# Altium project UL-SWAP-DAQ-1.PrjPcb (part 1 of 2)
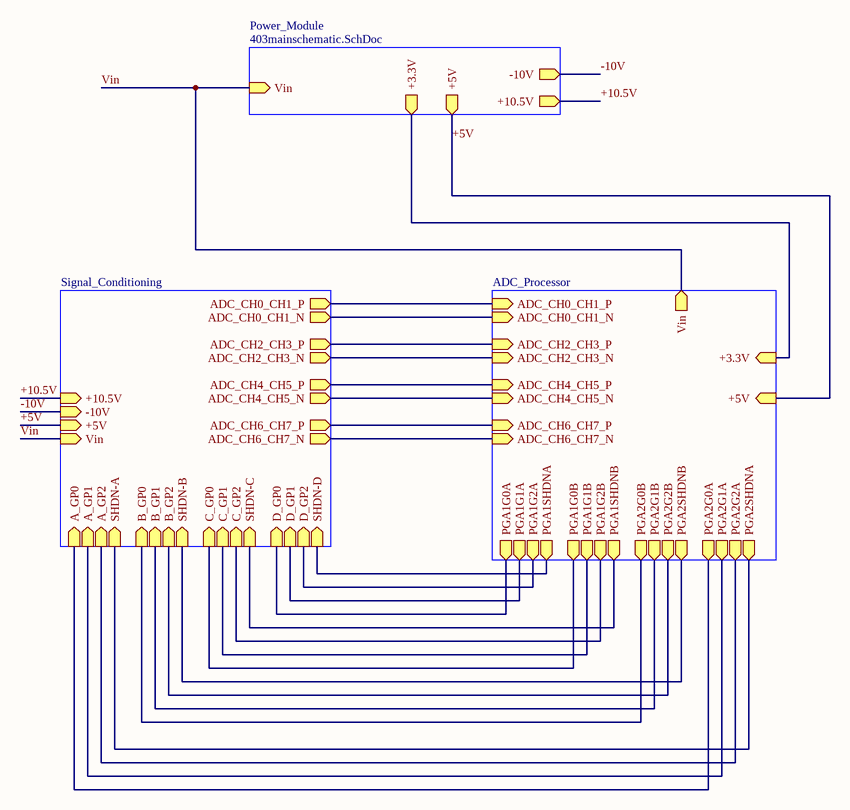
[diagram p0: UL-SWAP-DaQ-Schematic.SchDoc]
15 sheets, 164 parts. Net scope: hierarchical (ports join the sheet entries above them; power ports are global).
Board files: ADC_PIC32_LVDS_DRIVER_Subsystem.PcbDoc, UL-SWAP-DAQ-1.PcbDoc, UL-SWAP-DAQ-2.PcbDoc, pcb403.PcbDoc, Capstone_Signal_Conditioning_Subsystem_Test_PCB.PcbDoc, Power_PCB.PcbDoc, UL-SWAP-DAQ-3.PcbDoc
Sheets:
  UL-SWAP-DaQ-Schematic.SchDoc
    Signal_Conditioning = Capstone_Signal_Conditioners_Subsystem_Test_Schematic.SchDoc
      U4 = THS7002CPWP_Schematic.SchDoc
      U6 = LTC6362_Schematic.SchDoc
      U5 = THS7002CPWP_Schematic_2.SchDoc
      U8 = LTC6362_Schematic_2.SchDoc
    ADC_Processor = ADC_PIC32_LVDS_DRIVER_Subsystem.SchDoc
      ADC_Subsystem = ADC_Subsystem.SchDoc
      PIC32_Subsystem = PIC32_Subsystem.SchDoc
      LVDS_Driver_Subsystem = LVDS_Driver_Subsystem.SchDoc
      ICD4_INTERFACE_MODULE = ICD4_Interface_Module.SchDoc
    Power_Module = 403mainschematic.SchDoc
      LMR51420 3.3V = LMR514203.3V.SchDoc
      LMR51420 5V = LMR514205V.SchDoc
      TPS6513x = TPS6513x.SchDoc

## Sheet UL-SWAP-DaQ-Schematic.SchDoc
size A; SheetNumber: 1; SheetTotal: 15

### Sub-sheets
ADC_Processor = ADC_PIC32_LVDS_DRIVER_Subsystem.SchDoc: PGA1G0A (out), PGA1G1A (out), PGA1G2A (out), PGA1SHDNA (out), PGA1G0B (out), PGA1G2B (out), PGA1SHDNB (out), PGA1G1B (out), PGA2G0B (out), PGA2G1B (out), PGA2G2B (out), PGA2SHDNB (out), PGA2G0A (out), PGA2G1A (out), PGA2G2A (out), PGA2SHDNA (out), ADC_CH6_CH7_N (in), ADC_CH6_CH7_P (in), ADC_CH4_CH5_N (in), ADC_CH4_CH5_P (in), ADC_CH2_CH3_N (in), ADC_CH2_CH3_P (in), ADC_CH0_CH1_P (in), ADC_CH0_CH1_N (in), +5V (in), +3.3V (in), Vin (out)
Power_Module = 403mainschematic.SchDoc: Vin (in), -10V (out), +3.3V (out), +10.5V (out), +5V (out)
Signal_Conditioning = Capstone_Signal_Conditioners_Subsystem_Test_Schematic.SchDoc: A_GP0 (in), A_GP1 (in), A_GP2 (in), SHDN-A (in), B_GP0 (in), B_GP1 (in), B_GP2 (in), SHDN-B (in), C_GP0 (in), C_GP1 (in), C_GP2 (in), SHDN-C (in), D_GP2 (in), D_GP1 (in), D_GP0 (in), SHDN-D (in), ADC_CH0_CH1_P (out), ADC_CH0_CH1_N (out), ADC_CH2_CH3_P (out), ADC_CH2_CH3_N (out), ADC_CH4_CH5_N (out), ADC_CH4_CH5_P (out), ADC_CH6_CH7_P (out), ADC_CH6_CH7_N (out), +10.5V (in), -10V (in), +5V (in), Vin (in)

### Nets
+3.3V: sheet ADC_Processor/+3.3V, sheet Power_Module/+3.3V
+5V: sheet Signal_Conditioning/+5V, sheet ADC_Processor/+5V, sheet Power_Module/+5V
+10.5V: sheet Signal_Conditioning/+10.5V, sheet Power_Module/+10.5V
-10V: sheet Signal_Conditioning/-10V, sheet Power_Module/-10V
A_GP0: sheet Signal_Conditioning/A_GP0, sheet ADC_Processor/PGA2G0A
A_GP1: sheet Signal_Conditioning/A_GP1, sheet ADC_Processor/PGA2G1A
A_GP2: sheet Signal_Conditioning/A_GP2, sheet ADC_Processor/PGA2G2A
ADC_CH0_CH1_N: sheet Signal_Conditioning/ADC_CH0_CH1_N, sheet ADC_Processor/ADC_CH0_CH1_N
ADC_CH0_CH1_P: sheet Signal_Conditioning/ADC_CH0_CH1_P, sheet ADC_Processor/ADC_CH0_CH1_P
ADC_CH2_CH3_N: sheet Signal_Conditioning/ADC_CH2_CH3_N, sheet ADC_Processor/ADC_CH2_CH3_N
ADC_CH2_CH3_P: sheet Signal_Conditioning/ADC_CH2_CH3_P, sheet ADC_Processor/ADC_CH2_CH3_P
ADC_CH4_CH5_N: sheet Signal_Conditioning/ADC_CH4_CH5_N, sheet ADC_Processor/ADC_CH4_CH5_N
ADC_CH4_CH5_P: sheet Signal_Conditioning/ADC_CH4_CH5_P, sheet ADC_Processor/ADC_CH4_CH5_P
ADC_CH6_CH7_N: sheet Signal_Conditioning/ADC_CH6_CH7_N, sheet ADC_Processor/ADC_CH6_CH7_N
ADC_CH6_CH7_P: sheet Signal_Conditioning/ADC_CH6_CH7_P, sheet ADC_Processor/ADC_CH6_CH7_P
B_GP0: sheet Signal_Conditioning/B_GP0, sheet ADC_Processor/PGA2G0B
B_GP1: sheet Signal_Conditioning/B_GP1, sheet ADC_Processor/PGA2G1B
B_GP2: sheet Signal_Conditioning/B_GP2, sheet ADC_Processor/PGA2G2B
C_GP0: sheet Signal_Conditioning/C_GP0, sheet ADC_Processor/PGA1G0B
C_GP1: sheet Signal_Conditioning/C_GP1, sheet ADC_Processor/PGA1G1B
C_GP2: sheet Signal_Conditioning/C_GP2, sheet ADC_Processor/PGA1G2B
D_GP0: sheet Signal_Conditioning/D_GP0, sheet ADC_Processor/PGA1G0A
D_GP1: sheet Signal_Conditioning/D_GP1, sheet ADC_Processor/PGA1G1A
D_GP2: sheet Signal_Conditioning/D_GP2, sheet ADC_Processor/PGA1G2A
SHDN-A: sheet Signal_Conditioning/SHDN-A, sheet ADC_Processor/PGA2SHDNA
SHDN-B: sheet Signal_Conditioning/SHDN-B, sheet ADC_Processor/PGA2SHDNB
SHDN-C: sheet Signal_Conditioning/SHDN-C, sheet ADC_Processor/PGA1SHDNB
SHDN-D: sheet Signal_Conditioning/SHDN-D, sheet ADC_Processor/PGA1SHDNA
Vin: sheet Signal_Conditioning/Vin, sheet ADC_Processor/Vin, sheet Power_Module/Vin

## Sheet Capstone_Signal_Conditioners_Subsystem_Test_Schematic.SchDoc
size A; SheetNumber: 11; SheetTotal: 15
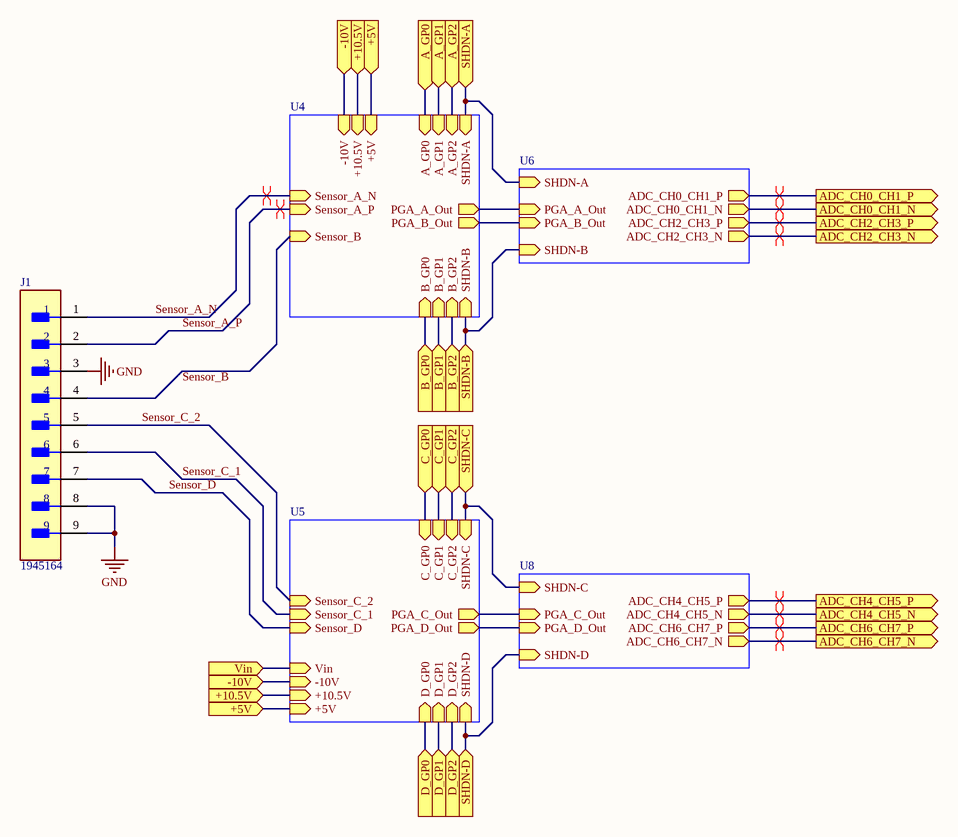
[diagram p1: Capstone_Signal_Conditioners_Subsystem_Test_Schematic.SchDoc]

### Parts
J1  1945164  [1945164]

### Sub-sheets
U4 = THS7002CPWP_Schematic.SchDoc: Sensor_A_P (in), Sensor_A_N (in), A_GP0 (in), A_GP1 (in), A_GP2 (in), PGA_A_Out (out), PGA_B_Out (out), B_GP0 (in), B_GP1 (in), B_GP2 (in), SHDN-A (in), SHDN-B (in), -10V (in), +10.5V (in), +5V (in), Sensor_B (in)
U5 = THS7002CPWP_Schematic_2.SchDoc: C_GP0 (in), D_GP0 (in), C_GP1 (in), C_GP2 (in), D_GP1 (in), D_GP2 (in), SHDN-C (in), SHDN-D (in), PGA_C_Out (out), PGA_D_Out (out), -10V (in), +10.5V (in), +5V (in), Vin (in), Sensor_C_1 (in), Sensor_C_2 (in), Sensor_D (in)
U6 = LTC6362_Schematic.SchDoc: PGA_A_Out (in), PGA_B_Out (in), SHDN-A (in), SHDN-B (in), ADC_CH0_CH1_P (out), ADC_CH0_CH1_N (out), ADC_CH2_CH3_N (out), ADC_CH2_CH3_P (out)
U8 = LTC6362_Schematic_2.SchDoc: SHDN-C (in), SHDN-D (in), ADC_CH6_CH7_N (out), ADC_CH6_CH7_P (out), ADC_CH4_CH5_N (out), ADC_CH4_CH5_P (out), PGA_C_Out (in), PGA_D_Out (in)

### Ports
+5V (in), +10.5V (in), -10V (in), A_GP0 (in), A_GP1 (in), A_GP2 (in), ADC_CH0_CH1_N (out), ADC_CH0_CH1_P (out), ADC_CH2_CH3_N (out), ADC_CH2_CH3_P (out), ADC_CH4_CH5_N (out), ADC_CH4_CH5_P (out), ADC_CH6_CH7_N (out), ADC_CH6_CH7_P (out), B_GP0 (in), B_GP1 (in), B_GP2 (in), C_GP0 (in), C_GP1 (in), C_GP2 (in), D_GP0 (in), D_GP1 (in), D_GP2 (in), SHDN-A (in), SHDN-B (in), SHDN-C (in), SHDN-D (in), Vin (in)

### Nets
+5V: port +5V, sheet U4/+5V, sheet U5/+5V
GND: J1.3 J1.8 J1.9
+10.5V: port +10.5V, sheet U4/+10.5V, sheet U5/+10.5V
-10V: port -10V, sheet U4/-10V, sheet U5/-10V
A_GP0: port A_GP0, sheet U4/A_GP0
A_GP1: port A_GP1, sheet U4/A_GP1
A_GP2: port A_GP2, sheet U4/A_GP2
ADC_CH0_CH1_N: port ADC_CH0_CH1_N, sheet U6/ADC_CH0_CH1_N
ADC_CH0_CH1_P: port ADC_CH0_CH1_P, sheet U6/ADC_CH0_CH1_P
ADC_CH2_CH3_N: port ADC_CH2_CH3_N, sheet U6/ADC_CH2_CH3_N
ADC_CH2_CH3_P: port ADC_CH2_CH3_P, sheet U6/ADC_CH2_CH3_P
ADC_CH4_CH5_N: port ADC_CH4_CH5_N, sheet U8/ADC_CH4_CH5_N
ADC_CH4_CH5_P: port ADC_CH4_CH5_P, sheet U8/ADC_CH4_CH5_P
ADC_CH6_CH7_N: port ADC_CH6_CH7_N, sheet U8/ADC_CH6_CH7_N
ADC_CH6_CH7_P: port ADC_CH6_CH7_P, sheet U8/ADC_CH6_CH7_P
B_GP0: port B_GP0, sheet U4/B_GP0
B_GP1: port B_GP1, sheet U4/B_GP1
B_GP2: port B_GP2, sheet U4/B_GP2
C_GP0: port C_GP0, sheet U5/C_GP0
C_GP1: port C_GP1, sheet U5/C_GP1
C_GP2: port C_GP2, sheet U5/C_GP2
D_GP0: port D_GP0, sheet U5/D_GP0
D_GP1: port D_GP1, sheet U5/D_GP1
D_GP2: port D_GP2, sheet U5/D_GP2
PGA_A_Out: sheet U4/PGA_A_Out, sheet U6/PGA_A_Out
PGA_B_Out: sheet U4/PGA_B_Out, sheet U6/PGA_B_Out
PGA_C_Out: sheet U5/PGA_C_Out, sheet U8/PGA_C_Out
PGA_D_Out: sheet U5/PGA_D_Out, sheet U8/PGA_D_Out
Sensor_A_N: J1.1 ; sheet U4/Sensor_A_N
Sensor_A_P: J1.2 ; sheet U4/Sensor_A_P
Sensor_B: J1.4 ; sheet U4/Sensor_B
Sensor_C_1: J1.6 ; sheet U5/Sensor_C_1
Sensor_C_2: J1.5 ; sheet U5/Sensor_C_2
Sensor_D: J1.7 ; sheet U5/Sensor_D
SHDN-A: port SHDN-A, sheet U4/SHDN-A, sheet U6/SHDN-A
SHDN-B: port SHDN-B, sheet U4/SHDN-B, sheet U6/SHDN-B
SHDN-C: port SHDN-C, sheet U5/SHDN-C, sheet U8/SHDN-C
SHDN-D: port SHDN-D, sheet U5/SHDN-D, sheet U8/SHDN-D
Vin: port Vin, sheet U5/Vin

### Layout directives
differential pair: ADC_CH0_CH1_N, ADC_CH0_CH1_P, ADC_CH2_CH3_N, ADC_CH2_CH3_P, ADC_CH4_CH5_N, ADC_CH4_CH5_P, ADC_CH6_CH7_N, ADC_CH6_CH7_P, Sensor_A_N, Sensor_A_P

### Notes on the sheet
- Labels drawn without touching a wire or pin: Sensor_B

### Library data of the parts
J1 = 1945164: TERM BLOCK HDR 9POS VERT 3.5MM; Manufacturer Part Number: 4-644456-0; Manufacturer: TE Connectivity; Current Rating: 5A; Conn Gender: Male; Number Of Contacts: 10; Conn Orientation: Vertical; Voltage Rating: 250V; Number Of Rows: 1; Device Class L3: unset; Octopart: https://octopart.com/4-644456-0-te+connectivity-39514173; Pitch: 3.5mm; Mouser Description: TERM BLOCK HDR 9POS VERT 3.5MM; ComponentLink2Description: Datasheet; Height: 0.408inch; Package: 4-644456-0; RoHS: TRUE; Temperature Range High: +105°C; Digikey Description: CONN HEADER VERT 10POS 2.54MM; Temperature: -55°C to +105°C; Device Class L2: Headers and Wire Housings; Automotive: No; Lead Free: Yes; Contact Material: Tin; Temperature Range Low: -55°C; Footprint Url: https://www.te.com/commerce/DocumentDelivery/DDEController?Action=showdoc&DocId=Customer+Drawing%7F644456%7FD2%7Fpdf%7FEnglish%7FENG_CD_644456_D2.pdf%7F4-644456-0; Device Class L1: Connectors; Category: Conn; ComponentLink2URL: https://media.digikey.com/pdf/Data%20Sheets/Phoenix%20Contact%20PDFs/Combicon%20Compact%20Series.pdf

## Sheet THS7002CPWP_Schematic.SchDoc
size A; SheetNumber: 12; SheetTotal: 15
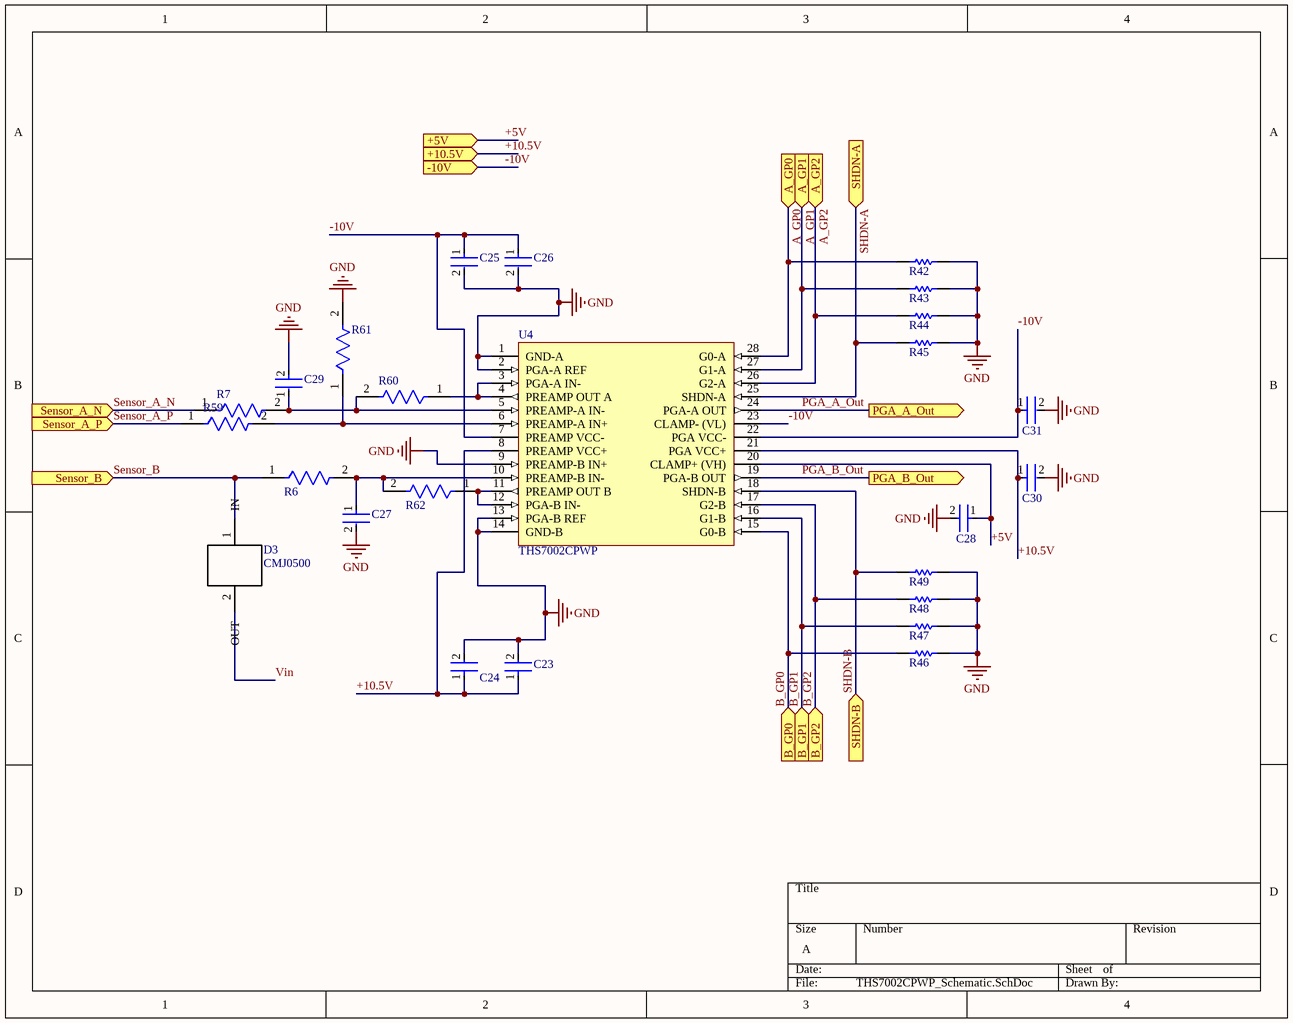
[diagram p2: THS7002CPWP_Schematic.SchDoc]

### Parts
C23  (no value)  [FP-C2012-060-0_2-IPC_A]
C24  CC0603KRX7R7BB104  [FP-CC0603-DA-MFG]  (value not drawn)
C25  CC0603KRX7R7BB104  [FP-CC0603-DA-MFG]  (value not drawn)
C26  (no value)  [FP-C2012-060-0_2-IPC_A]
C27  GRM2195C1H622JA01D  [FP-GRM219-0_1-IPC_C]  (value not drawn)
C28  (no value)  [FP-C2012-060-0_2-IPC_A]
C29  GRM2165C1H302JA01D  [FP-GRM216-0_1-IPC_A]  (value not drawn)
C30  CC0603KRX7R7BB104  [FP-CC0603-DA-MFG]  (value not drawn)
C31  CC0603KRX7R7BB104  [FP-CC0603-DA-MFG]  (value not drawn)
D3  CMJ0500  [CMJ2000_Footprint]
R6  CRCW0603499RFKEA  [FP-CRCW0603-e3-MFG]  (value not drawn)
R7  CRCW0603499RFKEA  [FP-CRCW0603-e3-MFG]  (value not drawn)
R42  RC0603FR-073K3L  [RESC1608X55X25ML10T15]  (value not drawn)
R43  RC0603FR-073K3L  [RESC1608X55X25ML10T15]  (value not drawn)
R44  RC0603FR-073K3L  [RESC1608X55X25ML10T15]  (value not drawn)
R45  RC0603FR-073K3L  [RESC1608X55X25ML10T15]  (value not drawn)
R46  RC0603FR-073K3L  [RESC1608X55X25ML10T15]  (value not drawn)
R47  RC0603FR-073K3L  [RESC1608X55X25ML10T15]  (value not drawn)
R48  RC0603FR-073K3L  [RESC1608X55X25ML10T15]  (value not drawn)
R49  RC0603FR-073K3L  [RESC1608X55X25ML10T15]  (value not drawn)
R59  CRCW0603499RFKEA  [FP-CRCW0603-e3-MFG]  (value not drawn)
R60  CRCW0603499RFKEA  [FP-CRCW0603-e3-MFG]  (value not drawn)
R61  CRCW0603499RFKEA  [FP-CRCW0603-e3-MFG]  (value not drawn)
R62  CRCW0603499RFKEA  [FP-CRCW0603-e3-MFG]  (value not drawn)
U4  THS7002CPWP  [THS7002CPWP]

### Ports
+5V (in), +10.5V (in), -10V (in), A_GP0 (in), A_GP1 (in), A_GP2 (in), B_GP0 (in), B_GP1 (in), B_GP2 (in), PGA_A_Out (out), PGA_B_Out (out), Sensor_A_N (in), Sensor_A_P (in), Sensor_B (in), SHDN-A (in), SHDN-B (in)

### Nets
+5V: C28.1 U4.20(CLAMP+_(VH)) ; port +5V
GND: C23.2 C24.2 C25.2 C26.2 C27.2 C28.2 C29.2 C30.2 C31.2 R42.1 R43.1 R44.1 R45.1 R46.1 R47.1 R48.1 R49.1 R61.2 U4.1(GND-A) U4.2(PGA-A_REF) U4.9(PREAMP-B_IN+) U4.13(PGA-B_REF) U4.14(GND-B)
+10.5V: C23.1 C24.1 C30.1 U4.8(PREAMP_VCC+) U4.21(PGA_VCC+) ; port +10.5V
-10V: C25.1 C26.1 C31.1 U4.7(PREAMP_VCC-) U4.22(PGA_VCC-) U4.23(CLAMP-_(VL)) ; port -10V
A_GP0: R42.2 U4.28(G0-A) ; port A_GP0
A_GP1: R43.2 U4.27(G1-A) ; port A_GP1
A_GP2: R44.2 U4.26(G2-A) ; port A_GP2
B_GP0: R46.2 U4.15(G0-B) ; port B_GP0
B_GP1: R47.2 U4.16(G1-B) ; port B_GP1
B_GP2: R48.2 U4.17(G2-B) ; port B_GP2
PGA_A_Out: U4.24(PGA-A_OUT) ; port PGA_A_Out
PGA_B_Out: U4.19(PGA-B_OUT) ; port PGA_B_Out
Sensor_A_N: R7.1 ; port Sensor_A_N
Sensor_A_P: R59.1 ; port Sensor_A_P
Sensor_B: R6.1 ; port Sensor_B
SHDN-A: R45.2 U4.25(SHDN-A) ; port SHDN-A
SHDN-B: R49.2 U4.18(SHDN-B) ; port SHDN-B
NetC27_1: C27.1 R6.2 R62.2 U4.10(PREAMP-B_IN-)
NetC29_1: C29.1 R7.2 R60.2 U4.5(PREAMP-A_IN-)
NetR59_2: R59.2 R61.1 U4.6(PREAMP-A_IN+)
NetR60_1: R60.1 U4.3(PGA-A_IN-) U4.4(PREAMP_OUT_A)
NetR62_1: R62.1 U4.11(PREAMP_OUT_B) U4.12(PGA-B_IN-)

Not connected (* = marked no-connect by the designer): D3 1(IN) 2(OUT)

### Library data of the parts
C23 C26 C28 = CMP-08246-004641-1: Multilayer Ceramic Capacitors 6.8μF ±10% 10V JB SMD 0805; Capacitance: 6.8uF; RoHS Compliant: Yes; Case Code (Metric): 5032; Case/Package: 0805; Voltage Rating: 10V; Width: 0.049inch; Min Operating Temperature: -25°C; Mount: Surface Mount; Voltage Rating (DC): 10V; Dielectric Material: Ceramic; Case Code (Imperial): 2012; Package Quantity: 4000; Lead Free: Lead Free; Packaging: Tape and Reel; Length: 0.079inch; Tolerance: 10%; Thickness: 0.028inch; Max Operating Temperature: 85°C; Series: C
C24 C25 C30 C31 = CMP-2000-05002-2: CAP CER 0.1UF 16V X7R 0603; Manufacturer: YAGEO; Tolerance: 0.1; Value: 100 nF; Temperature Coefficient: 15%; Material: Ceramic; Voltage Rating: 16 V; Package: CC0603-DA; ComponentLink2Description: Datasheet; Octopart: https://octopart.com/cc0603krx7r7bb104-yageo-192941; Temperature Range High: +125°C; Digikey Description: CAP CER 0.1UF 16V X7R 0603; Voltage: 16 V; Device Class L2: Capacitors; Height: 0.9mm; Temperature: -55°C to +125°C; Manufacturer Part Number: CC0603KRX7R7BB104; Device Class L1: Passive Components; Device Class L3: Ceramic Capacitors; ComponentLink2URL: http://www.yageo.com/documents/recent/UPY-GPHC_X7R_6.3V-to-50V_18.pdf; Footprint Url: http://www.yageo.com/exep/pages/download/literatures/UPY-C_GEN_24.pdf; RoHS: TRUE; Temperature Range Low: -55°C; Temperature Characteristic: X7R; Lead Free: Yes; Capacitance: 100 nF; Category: Cap; Mouser Description: Multilayer Ceramic Capacitor, CC Series, 0.1 - F, - 10%, X7R, 16 V, 0603 [1608 Metric]; Automotive: No
C27 = CMP-2007-00144-2: Chip Multilayer Ceramic Capacitors for General Purpose, 0805, 6200pF, C0G, 30ppm/°C, 5%, 50V; Capacitance: 6.2nF; Termination: SMD/SMT; Tolerance: 5%; Radiation Hardening: No; Voltage: 50V; Lead Free: Lead Free; Case Code (Imperial): 0805; Width: 0.049inch; Thickness: 0.037inch; Depth: 1.25mm; Mount: Surface Mount; Length: 2mm; Packaging: Tape and Reel; Voltage Rating (DC): 50V; Case/Package: 0805; Height: 0.85mm; Package Quantity: 1; Dielectric: C0G; Min Operating Temperature: -55°C; Max Operating Temperature: 125°C; Voltage Rating: 50V; Case Code (Metric): 2012
C29 = CMP-06035-063048-1: Chip Multilayer Ceramic Capacitors for General Purpose, 0805, 3000pF, C0G, 30ppm/°C, 5%, 50V; Capacitance: 3nF; Package Quantity: 1; Mount: Surface Mount; Voltage Rating: 50V; Length: 2mm; Case Code (Imperial): 0805; Depth: 1.25mm; Termination: SMD/SMT; Case Code (Metric): 2012; RoHS Compliant: Yes; Packaging: Tape and Reel; Case/Package: 0805; Width: 1.25mm; Height: 0.6mm; Max Operating Temperature: 125°C; Min Operating Temperature: -55°C; Voltage: 50V; Series: GRM; Voltage Rating (DC): 50V; Thickness: 0.028inch; Lead Free: Lead Free; Dielectric: C0G; Tolerance: 5%
D3 = CMJ2000/0130: CMJ0500: DIODE CUR REG 100V 0.5mA 500MW; ComponentLink1Description: New link; ComponentLink1URL: *
R6 R7 R59-R62 = CMP-2000-03390-2: RES Thick Film, 499Ω, 1%, 0.1W, 100ppm/°C, 0603; Voltage Rating (DC): 75V; Power Rating: 100mW; Resistance: 499R; Case/Package: 0603; Package Quantity: 5000; Military Standard: Not; Length: 1.55mm; Width: 0.85mm; Number of Terminations: 2; Lead Free: Lead Free; Height: 0.45mm; Weight: 7.1E-05oz; Composition: Thick Film; Radiation Hardening: No; Max Operating Temperature: 155°C; Tolerance: 1%; Working Voltage: 75V; Temperature Coefficient: 100ppm/°C; Packaging: Tape and Reel; Contact Plating: Tin; Termination: SMD/SMT; Depth: 0.85mm; Case Code (Metric): 1608; Min Operating Temperature: -55°C; Mount: Surface Mount; Case Code (Imperial): 0603; Voltage Rating: 75V
R42-R49 = CMP-1012-00567-2: Chip Resistor, 3.3 KOhm, +/- 1%, 0.1 W, -55 to 155 degC, 0603 (1608 Metric), RoHS, Tape and Reel; Manufacturer: Yageo; Temperature Coefficient: 100ppm/degreesC; Voltage Rating: 50V; Max Power Dissipation: 100mW; Resistance: 3.3KOhm; Case Code (Metric): 1608; Case/Package: 0603; Composition: ThickFilm; RoHSCompliant: true; Datasheet Version: Rev. 5, 10/2016; REACH SVHC: NoSVHC; Width: 0.8mm; Package Quantity: 1; Depth: 0.8mm; Voltage Rating (DC): 50V; Termination: SMD/SMT; Length: 1.6mm; Lead Free: LeadFree; Package Description: 2-Pin Surface Mount Device, Body 1.6 x 0.8 mm; Max Operating Temperature: 155degC; Tolerance: 1%; Height: 0.45mm; Number of Pins: 2; Military Standard: Not; Power Rating: 100mW; Datasheet URL: http://www.yageo.com/NewPortal/yageodocoutput?fileName=/pdf/R-Chip/PYu-RC_Group_51_RoHS_L_5.pdf; Case Code (Imperial): 0603; Manufacturer URL: http://www.yageo.com/; Packaging: TapeandReel; Min Operating Temperature: -55degC; Package Reference: 0603; Number of Terminations: 2
U4 = CMP-0988-00132-2: 70-MHz High-Speed Programmable-Gain Amplifier, Dual, 0 to 70 degC, 28-pin SOP (PWP28), Green (RoHS & no Sb/Br); Manufacturer: Texas Instruments; Disable: TRUE; BW @ Acl(MHz): 100; Vs(Min)(V): 9; Vs(Max)(V): 32; Number of Channels: 2; Vio(Max)(mV): 7; Iib(Max)(nA): 6000; SubFamily: Variable Gain Amplifier; Vn at Flatband(Typ)(nV/rtHz): 1.7; Slew Rate(Typ)(V/us): 85; ComponentLink1Description: Manufacturer URL; Code_JEDEC: MO-153; PackageVersion: 4073225-6/I, 05/2011; PackageReference: PWP0028E; Eco-Plan: Green (RoHS & no Sb/Br); ComponentLink2URL: http://www.ti.com/general/docs/lit/getliterature.tsp?genericPartNumber=THS7002&fileType=pdf; PackageDescription: 28-Pin Plastic Small Outline, Body 4.4 x 9.7 mm, Pitch 0.65 mm; DatasheetVersion: SLOS214C; ComponentLink3URL: http://www.ti.com/litv/pdf/mpds373; ComponentLink3Description: Package Specification; ComponentLink1URL: http://www.ti.com/; ComponentLink2Description: Datasheet; Mounting Technology: Surface Mount; PartNumber: THS7002CPWP

## Sheet LTC6362_Schematic.SchDoc
size A; SheetNumber: 13; SheetTotal: 15
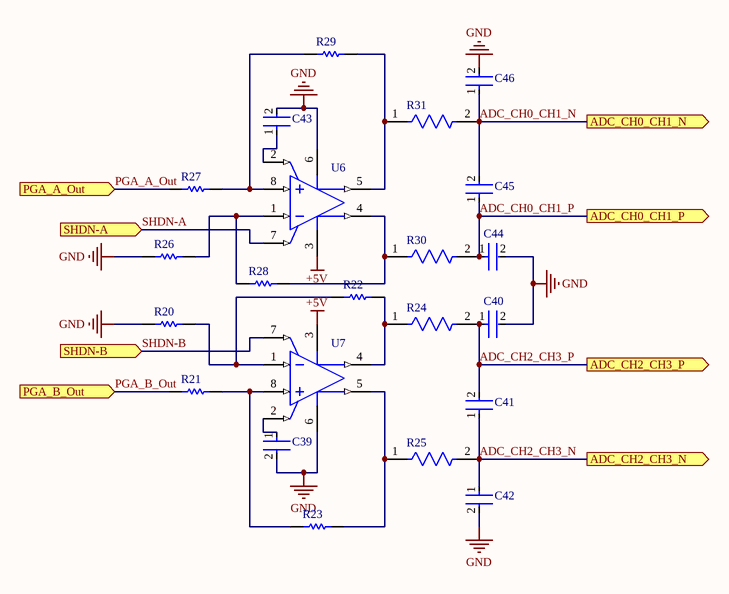
[diagram p3: LTC6362_Schematic.SchDoc]

### Parts
C39  GQM1875C2ER10BB12D  [FP-GQM187-0_15-MFG]  (value not drawn)
C40  CC0603KRX7R9BB392  [FP-CC0603-DA-MFG]  (value not drawn)
C41  CC0603KRX7R9BB392  [FP-CC0603-DA-MFG]  (value not drawn)
C42  CC0603KRX7R9BB392  [FP-CC0603-DA-MFG]  (value not drawn)
C43  GQM1875C2ER10BB12D  [FP-GQM187-0_15-MFG]  (value not drawn)
C44  CC0603KRX7R9BB392  [FP-CC0603-DA-MFG]  (value not drawn)
C45  CC0603KRX7R9BB392  [FP-CC0603-DA-MFG]  (value not drawn)
C46  CC0603KRX7R9BB392  [FP-CC0603-DA-MFG]  (value not drawn)
R20  ERJ-6ENF1241V  [RESC2013X70X40LL20T20]  (value not drawn)
R21  ERJ-6ENF1241V  [RESC2013X70X40LL20T20]  (value not drawn)
R22  RC0805FR-071KL  [RESC2013X60X35ML10T20]  (value not drawn)
R23  RC0805FR-071KL  [RESC2013X60X35ML10T20]  (value not drawn)
R24  CRCW060335R7FKEA  [FP-CRCW0603-e3-IPC_B]  (value not drawn)
R25  CRCW060335R7FKEA  [FP-CRCW0603-e3-IPC_B]  (value not drawn)
R26  ERJ-6ENF1241V  [RESC2013X70X40LL20T20]  (value not drawn)
R27  ERJ-6ENF1241V  [RESC2013X70X40LL20T20]  (value not drawn)
R28  RC0805FR-071KL  [RESC2013X60X35ML10T20]  (value not drawn)
R29  RC0805FR-071KL  [RESC2013X60X35ML10T20]  (value not drawn)
R30  CRCW060335R7FKEA  [FP-CRCW0603-e3-IPC_B]  (value not drawn)
R31  CRCW060335R7FKEA  [FP-CRCW0603-e3-IPC_B]  (value not drawn)
U6  LTC6362HMS8#PBF  [LT-MS8-8_L]  (value not drawn)
U7  LTC6362HMS8#PBF  [LT-MS8-8_L]  (value not drawn)

### Ports
ADC_CH0_CH1_N (out), ADC_CH0_CH1_P (out), ADC_CH2_CH3_N (out), ADC_CH2_CH3_P (out), PGA_A_Out (in), PGA_B_Out (in), SHDN-A (in), SHDN-B (in)

### Nets
+5V: U6.3(V+) U7.3(V+)
GND: C39.2 C40.2 C42.2 C43.2 C44.2 C46.2 R20.1 R26.1 U6.6(V-) U7.6(V-)
ADC_CH0_CH1_N: C45.2 C46.1 R31.2 ; port ADC_CH0_CH1_N
ADC_CH0_CH1_P: C44.1 C45.1 R30.2 ; port ADC_CH0_CH1_P
ADC_CH2_CH3_N: C41.1 C42.1 R25.2 ; port ADC_CH2_CH3_N
ADC_CH2_CH3_P: C40.1 C41.2 R24.2 ; port ADC_CH2_CH3_P
PGA_A_Out: R27.1 ; port PGA_A_Out
PGA_B_Out: R21.1 ; port PGA_B_Out
SHDN-A: U6.7(~{SHDN}) ; port SHDN-A
SHDN-B: U7.7(~{SHDN}) ; port SHDN-B
NetC39_1: C39.1 U7.2(VOCM)
NetC43_1: C43.1 U6.2(VOCM)
NetR20_2: R20.2 R22.1 U7.1(-IN)
NetR21_2: R21.2 R23.1 U7.8(+IN)
NetR22_2: R22.2 R24.1 U7.4(+OUT)
NetR23_2: R23.2 R25.1 U7.5(-OUT)
NetR26_2: R26.2 R28.1 U6.1(-IN)
NetR27_2: R27.2 R29.1 U6.8(+IN)
NetR28_2: R28.2 R30.1 U6.4(+OUT)
NetR29_2: R29.2 R31.1 U6.5(-OUT)

### Library data of the parts
C39 C43 = CMP-06035-052255-1: Ceramic Capacitor 0.1pF ±0.1pF 250VDC C0G 0603 Paper T/R; Voltage Rating: 250V; Width: 0.031inch; Length: 1.6mm; Max Operating Temperature: 125°C; Min Operating Temperature: -55°C; Height: 0.7mm; Dielectric: C0G; Termination: SMD/SMT; Depth: 0.8mm; Case/Package: 0603; Package Quantity: 4000; Radiation Hardening: No; Case Code (Metric): 1608; Thickness: 0.031inch; Capacitance: 0.1pF; Case Code (Imperial): 0603; Voltage Rating (DC): 250V; Packaging: Tape and Reel; Mount: Surface Mount
C40-C42 C44-C46 = CMP-03422-000635-2: CAP CER 3900PF 50V X7R 0603; Tolerance: 10%; Dielectric Material: Ceramic; Capacitance: 3.9nF; Insulation Resistance: 100GR; Height: 0.8mm; Voltage Rating: 50V; Termination: SMD/SMT; REACH SVHC: No SVHC; Resistor Type: Ceramic; Radiation Hardening: No; Case Code (Imperial): 0603; Voltage: 50V; Series: CC; Mount: Surface Mount; Length: 1.6mm; RoHS Compliant: Yes; Lead Free: Lead Free; Width: 0.8mm; Package Quantity: 4000; Packaging: Tape and Reel; Dielectric: X7R; Voltage Rating (DC): 50V; Min Operating Temperature: -55°C; Depth: 0.8mm; Halogen Free: Halogen Free; Case/Package: 0603; Thickness: 0.035inch; Number of Pins: 2; Max Operating Temperature: 125°C; Case Code (Metric): 1608; Construction: Flat
R20 R21 R26 R27 = CMP-2001-04406-1: Manufacturer: Panasonic; Part Number: ERJ-6ENF1241V
R22 R23 R28 R29 = CMP-2100-03671-1: Chip Resistor, 1 KOhm, +/- 1%, 125 mW, -55 to 155 degC, 0805 (2012 Metric), RoHS, Tape and Reel; Manufacturer: Yageo; Temperature Coefficient: 100ppm/degreesC; Voltage Rating (DC): 150V; Max Power Dissipation: 125mW; Resistance: 1KOhm; Number of Pins: 2; Number of Terminations: 2; Datasheet URL: http://www.yageo.com/NewPortal/yageodocoutput?fileName=/pdf/R-Chip/PYu-RC_Group_51_RoHS_L_5.pdf; Length: 0.079inch; Package Description: 2-Pin Surface Mounted Device, Body 2 x 1.25 mm; Depth: 1.25mm; Height: 0.024inch; Military Standard: Not; Case/Package: 0805; Package Reference: 0805; RoHSCompliant: true; Lead Free: LeadFree; Packaging: TapeandReel; Package Quantity: 1; Datasheet Version: Rev. 5, 10/2016; Tolerance: 1%; Min Operating Temperature: -55degC; Voltage Rating: 150V; Composition: ThickFilm; Case Code (Imperial): 0805; Power Rating: 125mW; Width: 0.049inch; Case Code (Metric): 2012; Manufacturer URL: http://www.yageo.com/; Max Operating Temperature: 155degC; REACH SVHC: Unknown; Termination: SMD/SMT
R24 R25 R30 R31 = CMP-02407-005475-1: RES Thick Film, 35.7Ω, 1%, 0.1W, 100ppm/°C, 0603; Resistance: 35.7R; Max Power Dissipation: 100mW; Voltage Rating (DC): 75V; Weight: 7.1E-05oz; Contact Plating: Tin; Width: 0.85mm; Features: Automotive AEC-Q200; Package Quantity: 10; Tolerance: 1%; Height: 0.02inch; Mount: Surface Mount; Packaging: Tape and Reel; Termination: SMD/SMT; Power Rating: 100mW; Case Code (Metric): 1608; Case/Package: 0603; Voltage Rating: 75V; Depth: 0.85mm; Number of Terminations: 2; Composition: Thick Film; Lead Free: Lead Free; Max Operating Temperature: 155°C; Case Code (Imperial): 0603; Min Operating Temperature: -55°C; Radiation Hardening: No; Length: 1.55mm; Number of Pins: 2; Military Standard: Not; Temperature Coefficient: 100ppm/°C
U6 U7 = CMP-0359-00920-2: Single Channel, Precision, Low Power Differential Operational Amplifier / SAR ADC Driver, RRIO, 180 MHz Typical GBW, 45 V/us Typical SR, 2.8 to 5.25 V, 8-Pin SOP (MS8-8), High Temperature / Automotive, Pb-Free; Manufacturer: Linear Technology; Vs Max (V): 5.25; Is (mA) Typical: 0.9; SR (V/us) Typical: 45; Channels (#): 1; GBW (MHz) Typical: 180; Vos (mV) Typical: 0.05; Vs Min (V): 2.8; PartNumber: LTC6362HMS8#PBF; PackageDescription: 8-Lead Plastic Small Outline, Body 3.9 x 4.9 mm, Pitch 1.27 mm; ComponentLink2Description: Datasheet; ComponentLink3URL: http://cds.linear.com/docs/en/packaging/05081610_G_SO8.pdf; ComponentLink1Description: Manufacturer URL; PackageReference: LT-MS8-8; ComponentLink2URL: http://cds.linear.com/docs/en/datasheet/6362fa.pdf; PackageVersion: Rev G; Mounting Technology: Surface Mount; Linear Technology Part Number: LTC6362; DatasheetVersion: Rev. A; RevisionNote: URLs updated; RoHS: Pb-Free; ComponentLink1URL: http://www.linear.com/; Type: DIFF; ComponentLink3Description: Package Specification

## Sheet THS7002CPWP_Schematic_2.SchDoc
size A; SheetNumber: 15; SheetTotal: 15
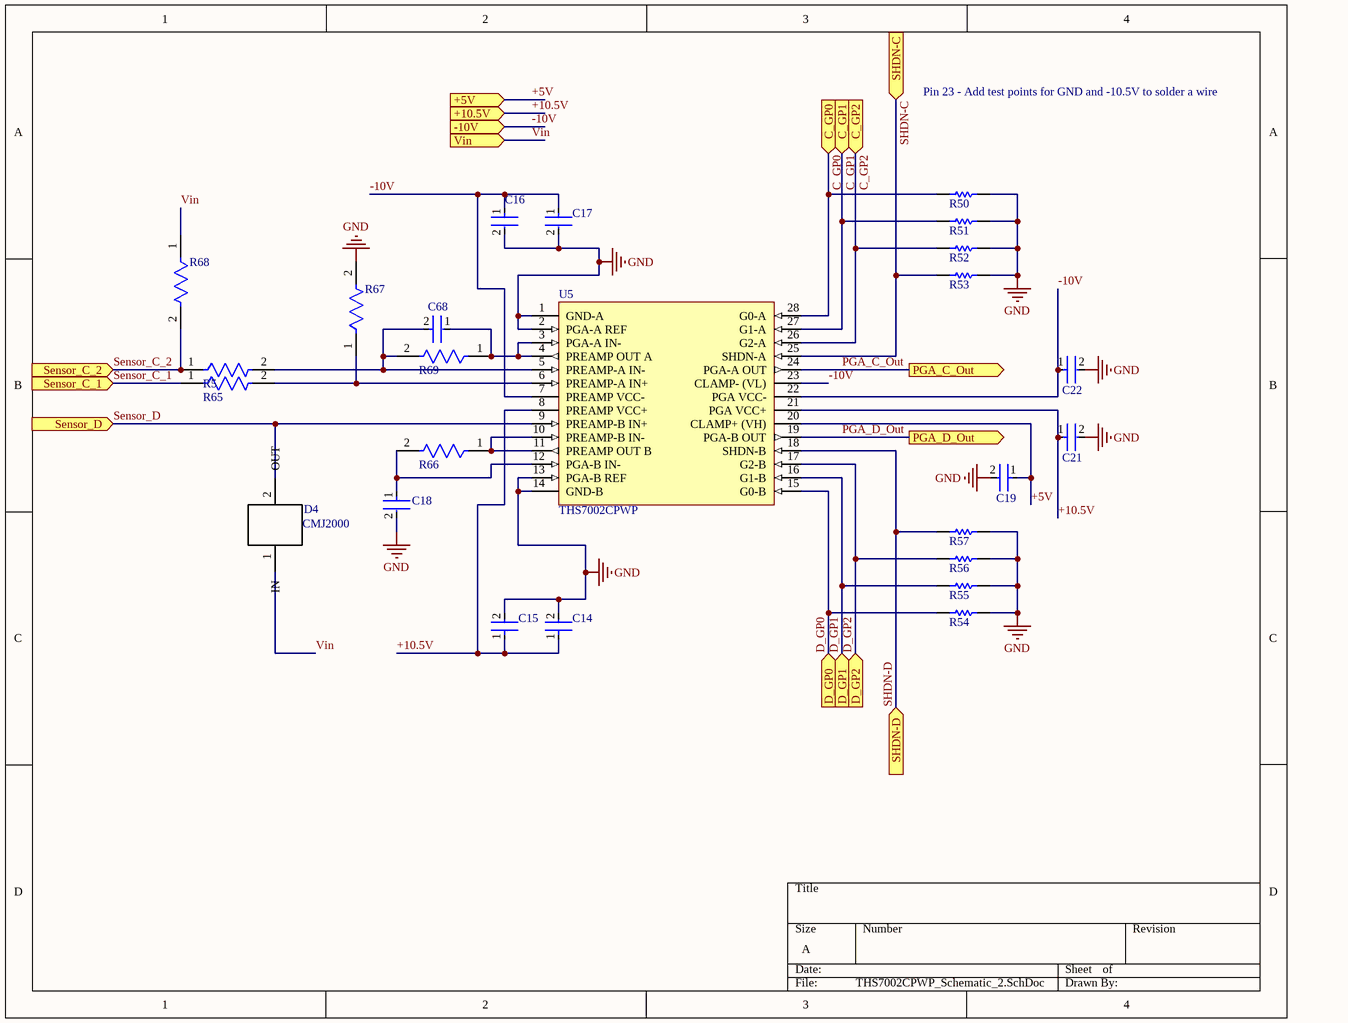
[diagram p4: THS7002CPWP_Schematic_2.SchDoc]

### Parts
C14  (no value)  [FP-C2012-060-0_2-IPC_A]
C15  CC0603KRX7R7BB104  [FP-CC0603-DA-MFG]  (value not drawn)
C16  CC0603KRX7R7BB104  [FP-CC0603-DA-MFG]  (value not drawn)
C17  (no value)  [FP-C2012-060-0_2-IPC_A]
C18  GRM2195C1H622JA01D  [FP-GRM219-0_1-IPC_C]  (value not drawn)
C19  (no value)  [FP-C2012-060-0_2-IPC_A]
C21  CC0603KRX7R7BB104  [FP-CC0603-DA-MFG]  (value not drawn)
C22  CC0603KRX7R7BB104  [FP-CC0603-DA-MFG]  (value not drawn)
C68  GRM31CR60J227ME11K  [FP-GRM31C-0_3-e0_3_0_9-IPC_C]  (value not drawn)
D4  CMJ2000  [CMJ2000_Footprint]
R5  CRCW0603499RFKEA  [FP-CRCW0603-e3-MFG]  (value not drawn)
R50  RC0603FR-073K3L  [RESC1608X55X25ML10T15]  (value not drawn)
R51  RC0603FR-073K3L  [RESC1608X55X25ML10T15]  (value not drawn)
R52  RC0603FR-073K3L  [RESC1608X55X25ML10T15]  (value not drawn)
R53  RC0603FR-073K3L  [RESC1608X55X25ML10T15]  (value not drawn)
R54  RC0603FR-073K3L  [RESC1608X55X25ML10T15]  (value not drawn)
R55  RC0603FR-073K3L  [RESC1608X55X25ML10T15]  (value not drawn)
R56  RC0603FR-073K3L  [RESC1608X55X25ML10T15]  (value not drawn)
R57  RC0603FR-073K3L  [RESC1608X55X25ML10T15]  (value not drawn)
R65  CRCW0603499RFKEA  [FP-CRCW0603-e3-MFG]  (value not drawn)
R66  CRCW0603499RFKEA  [FP-CRCW0603-e3-MFG]  (value not drawn)
R67  CRCW0603499RFKEA  [FP-CRCW0603-e3-MFG]  (value not drawn)
R68  RC0603FR-07100KL  [FP-RC0603-0_55-MFG]  (value not drawn)
R69  CRCW0603499RFKEA  [FP-CRCW0603-e3-MFG]  (value not drawn)
U5  THS7002CPWP  [THS7002CPWP]

### Ports
+5V (in), +10.5V (in), -10V (in), C_GP0 (in), C_GP1 (in), C_GP2 (in), D_GP0 (in), D_GP1 (in), D_GP2 (in), PGA_C_Out (out), PGA_D_Out (out), Sensor_C_1 (in), Sensor_C_2 (in), Sensor_D (in), SHDN-C (in), SHDN-D (in), Vin (in)

### Nets
+5V: C19.1 U5.20(CLAMP+_(VH)) ; port +5V
GND: C14.2 C15.2 C16.2 C17.2 C18.2 C19.2 C21.2 C22.2 R50.1 R51.1 R52.1 R53.1 R54.1 R55.1 R56.1 R57.1 R67.2 U5.1(GND-A) U5.2(PGA-A_REF) U5.13(PGA-B_REF) U5.14(GND-B)
+10.5V: C14.1 C15.1 C21.1 U5.8(PREAMP_VCC+) U5.21(PGA_VCC+) ; port +10.5V
-10V: C16.1 C17.1 C22.1 U5.7(PREAMP_VCC-) U5.22(PGA_VCC-) U5.23(CLAMP-_(VL)) ; port -10V
C_GP0: R50.2 U5.28(G0-A) ; port C_GP0
C_GP1: R51.2 U5.27(G1-A) ; port C_GP1
C_GP2: R52.2 U5.26(G2-A) ; port C_GP2
D_GP0: R54.2 U5.15(G0-B) ; port D_GP0
D_GP1: R55.2 U5.16(G1-B) ; port D_GP1
D_GP2: R56.2 U5.17(G2-B) ; port D_GP2
PGA_C_Out: U5.24(PGA-A_OUT) ; port PGA_C_Out
PGA_D_Out: U5.19(PGA-B_OUT) ; port PGA_D_Out
Sensor_C_1: R65.1 ; port Sensor_C_1
Sensor_C_2: R5.1 R68.2 ; port Sensor_C_2
Sensor_D: U5.9(PREAMP-B_IN+) ; port Sensor_D
SHDN-C: R53.2 U5.25(SHDN-A) ; port SHDN-C
SHDN-D: R57.2 U5.18(SHDN-B) ; port SHDN-D
Vin: R68.1 ; port Vin
NetC18_1: C18.1 R66.2 U5.12(PGA-B_IN-)
NetC68_1: C68.1 R69.1 U5.3(PGA-A_IN-) U5.4(PREAMP_OUT_A)
NetC68_2: C68.2 R5.2 R69.2 U5.5(PREAMP-A_IN-)
NetR65_2: R65.2 R67.1 U5.6(PREAMP-A_IN+)
NetR66_1: R66.1 U5.10(PREAMP-B_IN-) U5.11(PREAMP_OUT_B)

Not connected (* = marked no-connect by the designer): D4 1(IN) 2(OUT)

### Notes on the sheet
- Pin 23 - Add test points for GND and -10.5V to solder a wire

### Library data of the parts
C14 C17 C19 = CMP-08246-004641-1: as C23 on sheet THS7002CPWP_Schematic; RoHS Compliant: Yes; Case Code (Metric): 5032; Case/Package: 0805; Voltage Rating: 10V; Width: 0.049inch; Min Operating Temperature: -25°C; Mount: Surface Mount; Voltage Rating (DC): 10V; Dielectric Material: Ceramic; Case Code (Imperial): 2012; Package Quantity: 4000; Lead Free: Lead Free; Packaging: Tape and Reel; Length: 0.079inch; Tolerance: 10%; Thickness: 0.028inch; Max Operating Temperature: 85°C; Series: C
C15 C16 C21 C22 = CMP-2000-05002-2: as C24 on sheet THS7002CPWP_Schematic; Voltage Rating: 16 V; Package: CC0603-DA; ComponentLink2Description: Datasheet; Octopart: https://octopart.com/cc0603krx7r7bb104-yageo-192941; Temperature Range High: +125°C; Digikey Description: CAP CER 0.1UF 16V X7R 0603; Voltage: 16 V; Device Class L2: Capacitors; Height: 0.9mm; Temperature: -55°C to +125°C; Manufacturer Part Number: CC0603KRX7R7BB104; Device Class L1: Passive Components; Device Class L3: Ceramic Capacitors; ComponentLink2URL: http://www.yageo.com/documents/recent/UPY-GPHC_X7R_6.3V-to-50V_18.pdf; Footprint Url: http://www.yageo.com/exep/pages/download/literatures/UPY-C_GEN_24.pdf; RoHS: TRUE; Temperature Range Low: -55°C; Temperature Characteristic: X7R; Lead Free: Yes; Capacitance: 100 nF; Category: Cap; Mouser Description: Multilayer Ceramic Capacitor, CC Series, 0.1 - F, - 10%, X7R, 16 V, 0603 [1608 Metric]; Automotive: No
C18 = CMP-2007-00144-2: as C27 on sheet THS7002CPWP_Schematic; Termination: SMD/SMT; Tolerance: 5%; Radiation Hardening: No; Voltage: 50V; Lead Free: Lead Free; Case Code (Imperial): 0805; Width: 0.049inch; Thickness: 0.037inch; Depth: 1.25mm; Mount: Surface Mount; Length: 2mm; Packaging: Tape and Reel; Voltage Rating (DC): 50V; Case/Package: 0805; Height: 0.85mm; Package Quantity: 1; Dielectric: C0G; Min Operating Temperature: -55°C; Max Operating Temperature: 125°C; Voltage Rating: 50V; Case Code (Metric): 2012
C68 = CMP-06035-026847-1: Chip Multilayer Ceramic Capacitors for General Purpose, 1206, 220uF, X5R, 15%, 20%, 6.3V; Thickness: 1.6mm; Tolerance: 20%; Length: 3.2mm; Width: 1.6mm; Dielectric: X5R; Voltage Rating (DC): 6.3V; Capacitance: 220uF
D4 = CMJ2000: DIODE CUR REG 100V 2.32MA 500MW; ComponentLink1Description: New link; ComponentLink1URL: *
R5 R65-R67 R69 = CMP-2000-03390-2: as R6 on sheet THS7002CPWP_Schematic; Case/Package: 0603; Package Quantity: 5000; Military Standard: Not; Length: 1.55mm; Width: 0.85mm; Number of Terminations: 2; Lead Free: Lead Free; Height: 0.45mm; Weight: 7.1E-05oz; Composition: Thick Film; Radiation Hardening: No; Max Operating Temperature: 155°C; Tolerance: 1%; Working Voltage: 75V; Temperature Coefficient: 100ppm/°C; Packaging: Tape and Reel; Contact Plating: Tin; Termination: SMD/SMT; Depth: 0.85mm; Case Code (Metric): 1608; Min Operating Temperature: -55°C; Mount: Surface Mount; Case Code (Imperial): 0603; Voltage Rating: 75V
R50-R57 = CMP-1012-00567-2: as R42 on sheet THS7002CPWP_Schematic; Resistance: 3.3KOhm; Case Code (Metric): 1608; Case/Package: 0603; Composition: ThickFilm; RoHSCompliant: true; Datasheet Version: Rev. 5, 10/2016; REACH SVHC: NoSVHC; Width: 0.8mm; Package Quantity: 1; Depth: 0.8mm; Voltage Rating (DC): 50V; Termination: SMD/SMT; Length: 1.6mm; Lead Free: LeadFree; Package Description: 2-Pin Surface Mount Device, Body 1.6 x 0.8 mm; Max Operating Temperature: 155degC; Tolerance: 1%; Height: 0.45mm; Number of Pins: 2; Military Standard: Not; Power Rating: 100mW; Datasheet URL: http://www.yageo.com/NewPortal/yageodocoutput?fileName=/pdf/R-Chip/PYu-RC_Group_51_RoHS_L_5.pdf; Case Code (Imperial): 0603; Manufacturer URL: http://www.yageo.com/; Packaging: TapeandReel; Min Operating Temperature: -55degC; Package Reference: 0603; Number of Terminations: 2
R68 = CMP-2100-03662-2: RES SMD 100K OHM 1% 1/10W 0603; Voltage Rating (DC): 50V; Resistance: 100kR; Max Power Dissipation: 100mW; Temperature Coefficient: 100ppm/°C; Working Voltage: 75V; Length: 1.6mm; Lead Free: Lead Free; Number of Terminations: 2; Packaging: Tape and Reel; Voltage Rating: 50V; Termination: SMD/SMT; Width: 0.8mm; Resistor Type: Thick Film; Resistance Tolerance: 1%; Features: Moisture Resistant; Height: 0.45mm; Construction: Rectangular; Case/Package: 0603; Military Standard: Not; Case Code (Imperial): 0603; Series: RC; Technology: THICK FILM; Depth: 0.8mm; RoHS Compliant: Yes; REACH SVHC: No SVHC; Min Operating Temperature: -55°C; Case Code (Metric): 1608; Max Operating Temperature: 155°C; Power Rating: 100mW; Number of Pins: 2; Tolerance: 1%
U5 = CMP-0988-00132-2: as U4 on sheet THS7002CPWP_Schematic; ComponentLink1Description: Manufacturer URL; Code_JEDEC: MO-153; PackageVersion: 4073225-6/I, 05/2011; PackageReference: PWP0028E; Eco-Plan: Green (RoHS & no Sb/Br); ComponentLink2URL: http://www.ti.com/general/docs/lit/getliterature.tsp?genericPartNumber=THS7002&fileType=pdf; PackageDescription: 28-Pin Plastic Small Outline, Body 4.4 x 9.7 mm, Pitch 0.65 mm; DatasheetVersion: SLOS214C; ComponentLink3URL: http://www.ti.com/litv/pdf/mpds373; ComponentLink3Description: Package Specification; ComponentLink1URL: http://www.ti.com/; ComponentLink2Description: Datasheet; Mounting Technology: Surface Mount; PartNumber: THS7002CPWP

## Sheet LTC6362_Schematic_2.SchDoc
size A; SheetNumber: 14; SheetTotal: 15
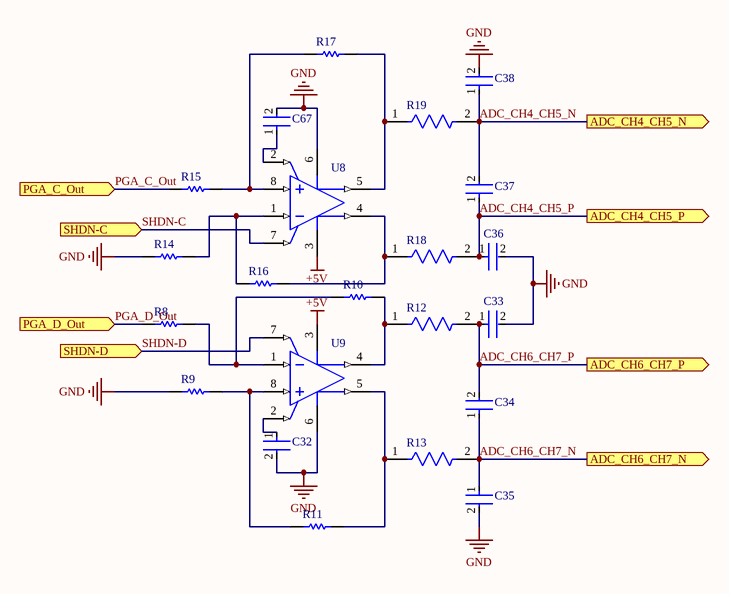
[diagram p5: LTC6362_Schematic_2.SchDoc]

### Parts
C32  GQM1875C2ER10BB12D  [FP-GQM187-0_15-MFG]  (value not drawn)
C33  CC0603KRX7R9BB392  [FP-CC0603-DA-MFG]  (value not drawn)
C34  CC0603KRX7R9BB392  [FP-CC0603-DA-MFG]  (value not drawn)
C35  CC0603KRX7R9BB392  [FP-CC0603-DA-MFG]  (value not drawn)
C36  CC0603KRX7R9BB392  [FP-CC0603-DA-MFG]  (value not drawn)
C37  CC0603KRX7R9BB392  [FP-CC0603-DA-MFG]  (value not drawn)
C38  CC0603KRX7R9BB392  [FP-CC0603-DA-MFG]  (value not drawn)
C67  GQM1875C2ER10BB12D  [FP-GQM187-0_15-MFG]  (value not drawn)
R8  ERJ-6ENF1241V  [RESC2013X70X40LL20T20]  (value not drawn)
R9  ERJ-6ENF1241V  [RESC2013X70X40LL20T20]  (value not drawn)
R10  RC0805FR-071KL  [RESC2013X60X35ML10T20]  (value not drawn)
R11  RC0805FR-071KL  [RESC2013X60X35ML10T20]  (value not drawn)
R12  CRCW060335R7FKEA  [FP-CRCW0603-e3-IPC_B]  (value not drawn)
R13  CRCW060335R7FKEA  [FP-CRCW0603-e3-IPC_B]  (value not drawn)
R14  ERJ-6ENF1241V  [RESC2013X70X40LL20T20]  (value not drawn)
R15  ERJ-6ENF1241V  [RESC2013X70X40LL20T20]  (value not drawn)
R16  RC0805FR-071KL  [RESC2013X60X35ML10T20]  (value not drawn)
R17  RC0805FR-071KL  [RESC2013X60X35ML10T20]  (value not drawn)
R18  CRCW060335R7FKEA  [FP-CRCW0603-e3-IPC_B]  (value not drawn)
R19  CRCW060335R7FKEA  [FP-CRCW0603-e3-IPC_B]  (value not drawn)
U8  LTC6362HMS8#PBF  [LT-MS8-8_L]  (value not drawn)
U9  LTC6362HMS8#PBF  [LT-MS8-8_L]  (value not drawn)

### Ports
ADC_CH4_CH5_N (out), ADC_CH4_CH5_P (out), ADC_CH6_CH7_N (out), ADC_CH6_CH7_P (out), PGA_C_Out (in), PGA_D_Out (in), SHDN-C (in), SHDN-D (in)

### Nets
+5V: U8.3(V+) U9.3(V+)
GND: C32.2 C33.2 C35.2 C36.2 C38.2 C67.2 R9.1 R14.1 U8.6(V-) U9.6(V-)
ADC_CH4_CH5_N: C37.2 C38.1 R19.2 ; port ADC_CH4_CH5_N
ADC_CH4_CH5_P: C36.1 C37.1 R18.2 ; port ADC_CH4_CH5_P
ADC_CH6_CH7_N: C34.1 C35.1 R13.2 ; port ADC_CH6_CH7_N
ADC_CH6_CH7_P: C33.1 C34.2 R12.2 ; port ADC_CH6_CH7_P
PGA_C_Out: R15.1 ; port PGA_C_Out
PGA_D_Out: R8.1 ; port PGA_D_Out
SHDN-C: U8.7(~{SHDN}) ; port SHDN-C
SHDN-D: U9.7(~{SHDN}) ; port SHDN-D
NetC32_1: C32.1 U9.2(VOCM)
NetC67_1: C67.1 U8.2(VOCM)
NetR8_2: R8.2 R10.1 U9.1(-IN)
NetR9_2: R9.2 R11.1 U9.8(+IN)
NetR10_2: R10.2 R12.1 U9.4(+OUT)
NetR11_2: R11.2 R13.1 U9.5(-OUT)
NetR14_2: R14.2 R16.1 U8.1(-IN)
NetR15_2: R15.2 R17.1 U8.8(+IN)
NetR16_2: R16.2 R18.1 U8.4(+OUT)
NetR17_2: R17.2 R19.1 U8.5(-OUT)

### Library data of the parts
C32 C67 = CMP-06035-052255-1: as C39 on sheet LTC6362_Schematic; Width: 0.031inch; Length: 1.6mm; Max Operating Temperature: 125°C; Min Operating Temperature: -55°C; Height: 0.7mm; Dielectric: C0G; Termination: SMD/SMT; Depth: 0.8mm; Case/Package: 0603; Package Quantity: 4000; Radiation Hardening: No; Case Code (Metric): 1608; Thickness: 0.031inch; Capacitance: 0.1pF; Case Code (Imperial): 0603; Voltage Rating (DC): 250V; Packaging: Tape and Reel; Mount: Surface Mount
C33-C38 = CMP-03422-000635-2: as C40 on sheet LTC6362_Schematic; Height: 0.8mm; Voltage Rating: 50V; Termination: SMD/SMT; REACH SVHC: No SVHC; Resistor Type: Ceramic; Radiation Hardening: No; Case Code (Imperial): 0603; Voltage: 50V; Series: CC; Mount: Surface Mount; Length: 1.6mm; RoHS Compliant: Yes; Lead Free: Lead Free; Width: 0.8mm; Package Quantity: 4000; Packaging: Tape and Reel; Dielectric: X7R; Voltage Rating (DC): 50V; Min Operating Temperature: -55°C; Depth: 0.8mm; Halogen Free: Halogen Free; Case/Package: 0603; Thickness: 0.035inch; Number of Pins: 2; Max Operating Temperature: 125°C; Case Code (Metric): 1608; Construction: Flat
R8 R9 R14 R15 = CMP-2001-04406-1: Manufacturer: Panasonic; Part Number: ERJ-6ENF1241V
R10 R11 R16 R17 = CMP-2100-03671-1: as R22 on sheet LTC6362_Schematic; Number of Pins: 2; Number of Terminations: 2; Datasheet URL: http://www.yageo.com/NewPortal/yageodocoutput?fileName=/pdf/R-Chip/PYu-RC_Group_51_RoHS_L_5.pdf; Length: 0.079inch; Package Description: 2-Pin Surface Mounted Device, Body 2 x 1.25 mm; Depth: 1.25mm; Height: 0.024inch; Military Standard: Not; Case/Package: 0805; Package Reference: 0805; RoHSCompliant: true; Lead Free: LeadFree; Packaging: TapeandReel; Package Quantity: 1; Datasheet Version: Rev. 5, 10/2016; Tolerance: 1%; Min Operating Temperature: -55degC; Voltage Rating: 150V; Composition: ThickFilm; Case Code (Imperial): 0805; Power Rating: 125mW; Width: 0.049inch; Case Code (Metric): 2012; Manufacturer URL: http://www.yageo.com/; Max Operating Temperature: 155degC; REACH SVHC: Unknown; Termination: SMD/SMT
R12 R13 R18 R19 = CMP-02407-005475-1: as R24 on sheet LTC6362_Schematic; Weight: 7.1E-05oz; Contact Plating: Tin; Width: 0.85mm; Features: Automotive AEC-Q200; Package Quantity: 10; Tolerance: 1%; Height: 0.02inch; Mount: Surface Mount; Packaging: Tape and Reel; Termination: SMD/SMT; Power Rating: 100mW; Case Code (Metric): 1608; Case/Package: 0603; Voltage Rating: 75V; Depth: 0.85mm; Number of Terminations: 2; Composition: Thick Film; Lead Free: Lead Free; Max Operating Temperature: 155°C; Case Code (Imperial): 0603; Min Operating Temperature: -55°C; Radiation Hardening: No; Length: 1.55mm; Number of Pins: 2; Military Standard: Not; Temperature Coefficient: 100ppm/°C
U8 U9 = CMP-0359-00920-2: as U6 on sheet LTC6362_Schematic; PartNumber: LTC6362HMS8#PBF; PackageDescription: 8-Lead Plastic Small Outline, Body 3.9 x 4.9 mm, Pitch 1.27 mm; ComponentLink2Description: Datasheet; ComponentLink3URL: http://cds.linear.com/docs/en/packaging/05081610_G_SO8.pdf; ComponentLink1Description: Manufacturer URL; PackageReference: LT-MS8-8; ComponentLink2URL: http://cds.linear.com/docs/en/datasheet/6362fa.pdf; PackageVersion: Rev G; Mounting Technology: Surface Mount; Linear Technology Part Number: LTC6362; DatasheetVersion: Rev. A; RevisionNote: URLs updated; RoHS: Pb-Free; ComponentLink1URL: http://www.linear.com/; Type: DIFF; ComponentLink3Description: Package Specification

## Sheet ADC_PIC32_LVDS_DRIVER_Subsystem.SchDoc
size A; SheetNumber: 2; SheetTotal: 15
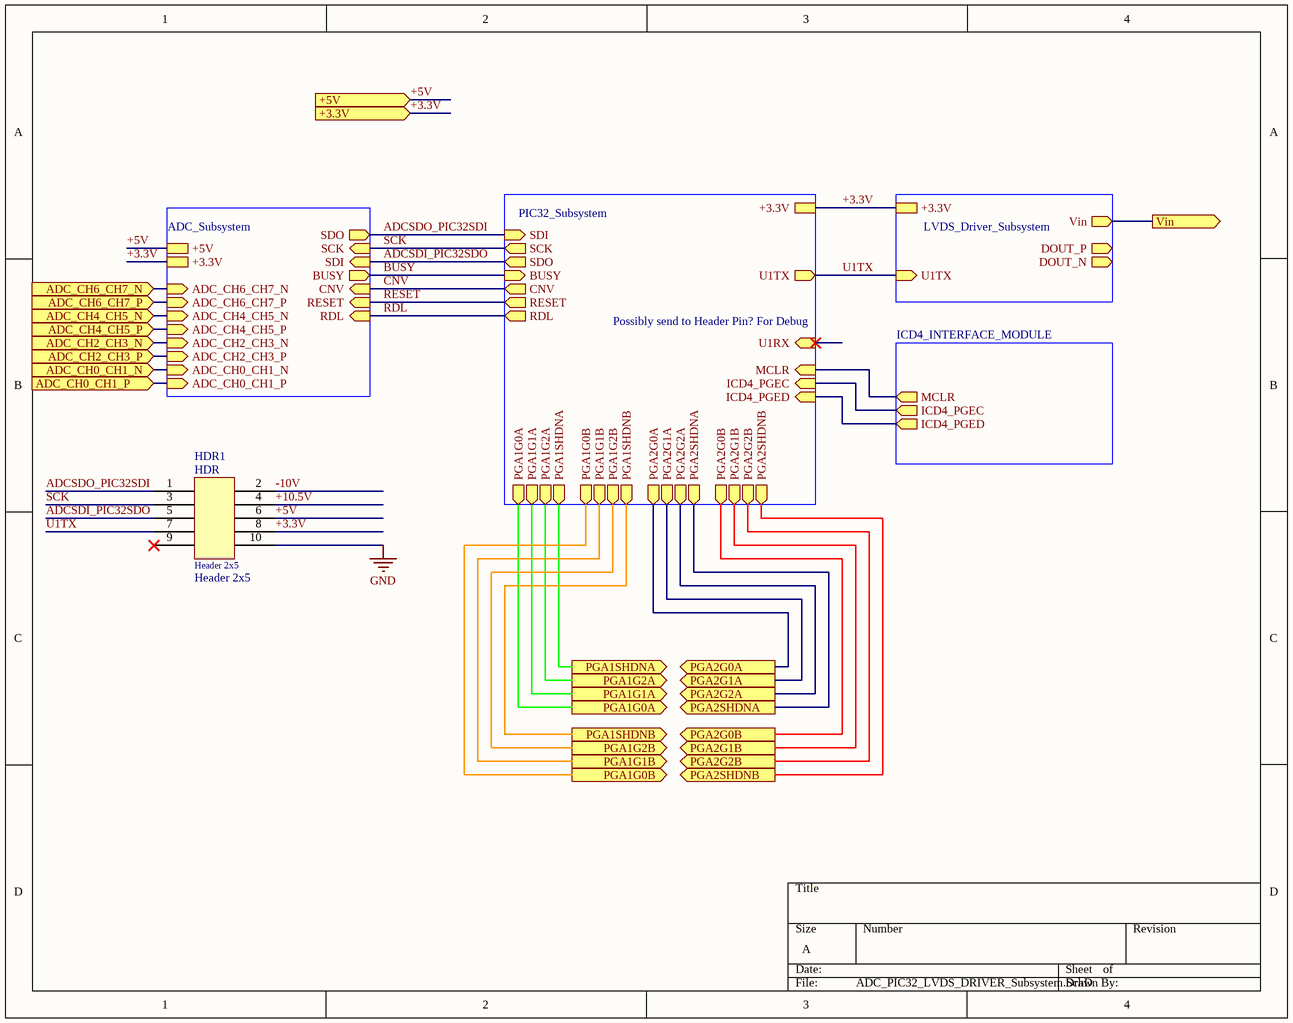
[diagram p6: ADC_PIC32_LVDS_DRIVER_Subsystem.SchDoc]

### Parts
HDR1  Header 2x5

### Sub-sheets
ADC_Subsystem = ADC_Subsystem.SchDoc: SDO (out), SCK (in), SDI (in), BUSY (out), CNV (in), RESET (in), RDL (in), +5V, +3.3V, ADC_CH6_CH7_N (in), ADC_CH6_CH7_P (in), ADC_CH4_CH5_N (in), ADC_CH4_CH5_P (in), ADC_CH2_CH3_N (in), ADC_CH2_CH3_P (in), ADC_CH0_CH1_P (in), ADC_CH0_CH1_N (in)
ICD4_INTERFACE_MODULE = ICD4_Interface_Module.SchDoc: MCLR (out), ICD4_PGEC (out), ICD4_PGED (out)
LVDS_Driver_Subsystem = LVDS_Driver_Subsystem.SchDoc: DOUT_P (out), DOUT_N (out), U1TX (in), +3.3V, Vin (out)
PIC32_Subsystem = PIC32_Subsystem.SchDoc: U1TX (out), U1RX (in), BUSY (in), RESET (out), CNV (out), SDO (out), SCK (out), SDI (in), RDL (out), ICD4_PGED (in), ICD4_PGEC (in), MCLR (in), PGA1G0A (out), PGA1G1A (out), PGA1G2A (out), PGA1SHDNA (out), PGA1G0B (out), PGA1G1B (out), PGA1G2B (out), PGA1SHDNB (out), PGA2G0A (out), PGA2G1A (out), PGA2G2A (out), PGA2SHDNA (out), PGA2G0B (out), PGA2G1B (out), PGA2G2B (out), PGA2SHDNB (out), +3.3V

### Ports
+3.3V (in), +5V (in), ADC_CH0_CH1_N (in), ADC_CH0_CH1_P (in), ADC_CH2_CH3_N (in), ADC_CH2_CH3_P (in), ADC_CH4_CH5_N (in), ADC_CH4_CH5_P (in), ADC_CH6_CH7_N (in), ADC_CH6_CH7_P (in), PGA1G0A (out), PGA1G0B (out), PGA1G1A (out), PGA1G1B (out), PGA1G2A (out), PGA1G2B (out), PGA1SHDNA (out), PGA1SHDNB (out), PGA2G0A (out), PGA2G0B (out), PGA2G1A (out), PGA2G1B (out), PGA2G2A (out), PGA2G2B (out), PGA2SHDNA (out), PGA2SHDNB (out), Vin (out)

### Nets
+3.3V: port +3.3V, sheet ADC_Subsystem/+3.3V, sheet PIC32_Subsystem/+3.3V, sheet LVDS_Driver_Subsystem/+3.3V
+5V: port +5V, sheet ADC_Subsystem/+5V
A_GP0: port PGA2G0A, sheet PIC32_Subsystem/PGA2G0A
A_GP1: port PGA2G1A, sheet PIC32_Subsystem/PGA2G1A
A_GP2: port PGA2G2A, sheet PIC32_Subsystem/PGA2G2A
ADC_CH0_CH1_N: port ADC_CH0_CH1_N, sheet ADC_Subsystem/ADC_CH0_CH1_N
ADC_CH0_CH1_P: port ADC_CH0_CH1_P, sheet ADC_Subsystem/ADC_CH0_CH1_P
ADC_CH2_CH3_N: port ADC_CH2_CH3_N, sheet ADC_Subsystem/ADC_CH2_CH3_N
ADC_CH2_CH3_P: port ADC_CH2_CH3_P, sheet ADC_Subsystem/ADC_CH2_CH3_P
ADC_CH4_CH5_N: port ADC_CH4_CH5_N, sheet ADC_Subsystem/ADC_CH4_CH5_N
ADC_CH4_CH5_P: port ADC_CH4_CH5_P, sheet ADC_Subsystem/ADC_CH4_CH5_P
ADC_CH6_CH7_N: port ADC_CH6_CH7_N, sheet ADC_Subsystem/ADC_CH6_CH7_N
ADC_CH6_CH7_P: port ADC_CH6_CH7_P, sheet ADC_Subsystem/ADC_CH6_CH7_P
ADCSDI_PIC32SDO: sheet ADC_Subsystem/SDI, sheet PIC32_Subsystem/SDO
ADCSDO_PIC32SDI: sheet ADC_Subsystem/SDO, sheet PIC32_Subsystem/SDI
B_GP0: port PGA2G0B, sheet PIC32_Subsystem/PGA2G0B
B_GP1: port PGA2G1B, sheet PIC32_Subsystem/PGA2G1B
B_GP2: port PGA2G2B, sheet PIC32_Subsystem/PGA2G2B
BUSY: sheet ADC_Subsystem/BUSY, sheet PIC32_Subsystem/BUSY
C_GP0: port PGA1G0B, sheet PIC32_Subsystem/PGA1G0B
C_GP1: port PGA1G1B, sheet PIC32_Subsystem/PGA1G1B
C_GP2: port PGA1G2B, sheet PIC32_Subsystem/PGA1G2B
CNV: sheet ADC_Subsystem/CNV, sheet PIC32_Subsystem/CNV
D_GP0: port PGA1G0A, sheet PIC32_Subsystem/PGA1G0A
D_GP1: port PGA1G1A, sheet PIC32_Subsystem/PGA1G1A
D_GP2: port PGA1G2A, sheet PIC32_Subsystem/PGA1G2A
MCLR: sheet PIC32_Subsystem/MCLR, sheet ICD4_INTERFACE_MODULE/MCLR
PGC: sheet PIC32_Subsystem/ICD4_PGEC, sheet ICD4_INTERFACE_MODULE/ICD4_PGEC
PGD: sheet PIC32_Subsystem/ICD4_PGED, sheet ICD4_INTERFACE_MODULE/ICD4_PGED
RDL: sheet ADC_Subsystem/RDL, sheet PIC32_Subsystem/RDL
RESET: sheet ADC_Subsystem/RESET, sheet PIC32_Subsystem/RESET
SCK: sheet ADC_Subsystem/SCK, sheet PIC32_Subsystem/SCK
SHDN-A: port PGA2SHDNA, sheet PIC32_Subsystem/PGA2SHDNA
SHDN-B: port PGA2SHDNB, sheet PIC32_Subsystem/PGA2SHDNB
SHDN-C: port PGA1SHDNB, sheet PIC32_Subsystem/PGA1SHDNB
SHDN-D: port PGA1SHDNA, sheet PIC32_Subsystem/PGA1SHDNA
U1TX: sheet PIC32_Subsystem/U1TX, sheet LVDS_Driver_Subsystem/U1TX
Vin: port Vin, sheet LVDS_Driver_Subsystem/Vin

Not connected (* = marked no-connect by the designer): HDR1 1 2 3 4 5 6 7 8 9 10

### Notes on the sheet
- Possibly send to Header Pin? For Debug

### Library data of the parts
HDR1 = HDR

## Sheet ADC_Subsystem.SchDoc
size A; SheetNumber: 4; SheetTotal: 15
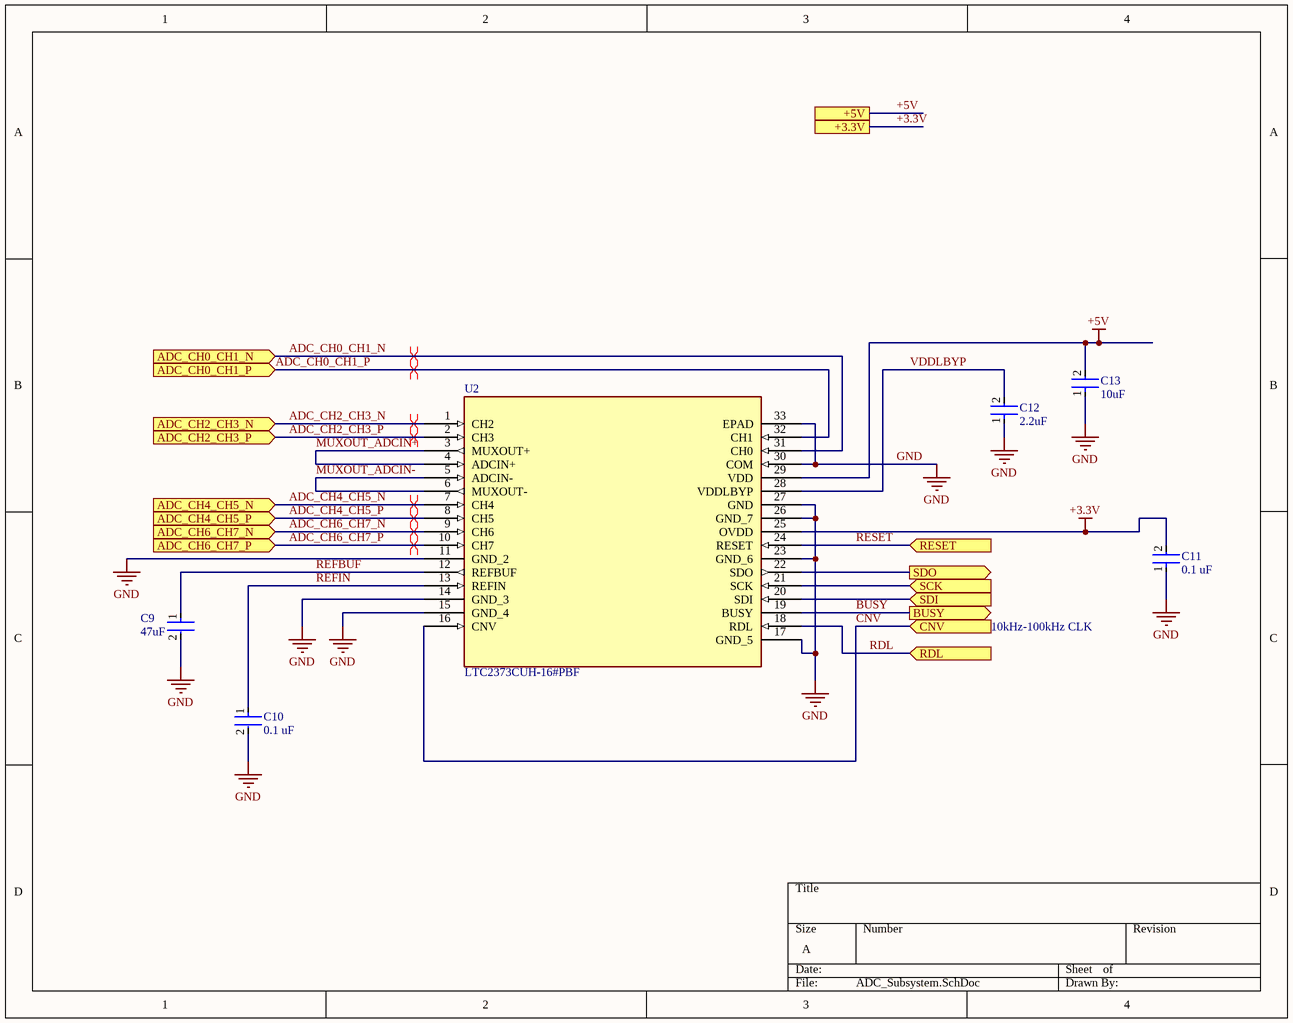
[diagram p7: ADC_Subsystem.SchDoc]

### Parts
C9  47uF  [FP-C0805C476M9PACTU-MFG]
C10  0.1 uF  [FP-CC0603-DA-MFG]
C11  0.1 uF  [FP-CC0603-DA-MFG]
C12  2.2uF  [FP-GRM188-0_1-e0_2_0_5-MFG]
C13  10uF  [FP-GRM188-0_1-e0_2_0_55-IPC_A]
U2  LTC2373CUH-16#PBF  [LTC_2373_Footprint]

### Ports
+3.3V, +5V, ADC_CH0_CH1_N (in), ADC_CH0_CH1_P (in), ADC_CH2_CH3_N (in), ADC_CH2_CH3_P (in), ADC_CH4_CH5_N (in), ADC_CH4_CH5_P (in), ADC_CH6_CH7_N (in), ADC_CH6_CH7_P (in), BUSY (out), CNV (in), RDL (in), RESET (in), SCK (in), SDI (in), SDO (out)

### Nets
+3.3V: C11.2 U2.25(OVDD) ; port +3.3V
+5V: C13.2 U2.29(VDD) ; port +5V
GND: C9.2 C10.2 C11.1 C12.1 C13.1 U2.11(GND_2) U2.14(GND_3) U2.15(GND_4) U2.17(GND_5) U2.23(GND_6) U2.26(GND_7) U2.27(GND) U2.30(COM) U2.33(EPAD)
ADC_CH0_CH1_N: U2.31(CH0) ; port ADC_CH0_CH1_N
ADC_CH0_CH1_P: U2.32(CH1) ; port ADC_CH0_CH1_P
ADC_CH2_CH3_N: U2.1(CH2) ; port ADC_CH2_CH3_N
ADC_CH2_CH3_P: U2.2(CH3) ; port ADC_CH2_CH3_P
ADC_CH4_CH5_N: U2.7(CH4) ; port ADC_CH4_CH5_N
ADC_CH4_CH5_P: U2.8(CH5) ; port ADC_CH4_CH5_P
ADC_CH6_CH7_N: U2.9(CH6) ; port ADC_CH6_CH7_N
ADC_CH6_CH7_P: U2.10(CH7) ; port ADC_CH6_CH7_P
ADCSDI_PIC32SDO: U2.20(SDI) ; port SDI
ADCSDO_PIC32SDI: U2.22(SDO) ; port SDO
BUSY: U2.19(BUSY) ; port BUSY
CNV: U2.16(CNV) ; port CNV
MUXOUT_ADCIN+: U2.3(MUXOUT+) U2.4(ADCIN+)
MUXOUT_ADCIN-: U2.5(ADCIN-) U2.6(MUXOUT-)
RDL: U2.18(RDL) ; port RDL
REFBUF: C9.1 U2.12(REFBUF)
REFIN: C10.1 U2.13(REFIN)
RESET: U2.24(RESET) ; port RESET
SCK: U2.21(SCK) ; port SCK
VDDLBYP: C12.2 U2.28(VDDLBYP)

### Layout directives
differential pair: ADC_CH0_CH1_N, ADC_CH0_CH1_P, ADC_CH2_CH3_N, ADC_CH2_CH3_P, ADC_CH4_CH5_N, ADC_CH4_CH5_P, ADC_CH6_CH7_N, ADC_CH6_CH7_P

### Notes on the sheet
- 10kHz-100kHz CLK

### Library data of the parts
C9 = CMP-2007-01008-2: CAP CER 47UF 6.3V X5R 0805 / C0805C476M9PACTU; Dielectric Material: Ceramic; Dissipation Factor: 5%; Tolerance: 20%; Case Code (Imperial): 0805; Mount: PCB; Width: 1.2mm; Package Quantity: 3000; Radiation Hardening: No; Packaging: Tape and Reel; Termination: SMD/SMT; Series: C0805C; Voltage: 6.3V; Depth: 1.25mm; Dielectric: X5R; Case Code (Metric): 2012; Length: 2mm; Case/Package: 0805; REACH SVHC: No SVHC; Voltage Rating (DC): 6.3V; Capacitance: 47uF; RoHS Compliant: Yes; Height: 1.25mm; Construction: Flat; Number of Pins: 2; Voltage Rating: 6.3V; Max Operating Temperature: 85°C; Min Operating Temperature: -55°C
C10 C11 = CMP-2000-05002-2: CAP CER 0.1UF 16V X7R 0603 CC0603KRX7R7BB104; Manufacturer: YAGEO; Tolerance: 0.1; Value: 100 nF; Temperature Coefficient: 15%; Material: Ceramic; Voltage Rating: 16 V; Package: CC0603-DA; ComponentLink2Description: Datasheet; Octopart: https://octopart.com/cc0603krx7r7bb104-yageo-192941; Temperature Range High: +125°C; Digikey Description: CAP CER 0.1UF 16V X7R 0603; Voltage: 16 V; Device Class L2: Capacitors; Height: 0.9mm; Temperature: -55°C to +125°C; Manufacturer Part Number: CC0603KRX7R7BB104; Device Class L1: Passive Components; Device Class L3: Ceramic Capacitors; ComponentLink2URL: http://www.yageo.com/documents/recent/UPY-GPHC_X7R_6.3V-to-50V_18.pdf; Footprint Url: http://www.yageo.com/exep/pages/download/literatures/UPY-C_GEN_24.pdf; RoHS: TRUE; Temperature Range Low: -55°C; Temperature Characteristic: X7R; Lead Free: Yes; Capacitance: 100 nF; Category: Cap; Mouser Description: Multilayer Ceramic Capacitor, CC Series, 0.1 - F, - 10%, X7R, 16 V, 0603 [1608 Metric]; Automotive: No
C12 = CMP-2006-02836-2: Chip Multilayer Ceramic Capacitors for General Purpose, 0603, 2.2uF, X7R, 15%, 10%, 10V / GRM188R71A225KE15D; Case Code (Metric): 1608; Height: 0.8mm; Packaging: Cut Tape; Voltage: 10V; Lead Free: Lead Free; Min Operating Temperature: -55°C; Voltage Rating (DC): 10V; Max Operating Temperature: 125°C; Voltage Rating: 10V; Dielectric: X7R; Depth: 0.8mm; Case Code (Imperial): 0603; Termination: SMD/SMT; Case/Package: 0603; Number of Pins: 2; REACH SVHC: No SVHC; Mount: Surface Mount; Width: 0.031inch; Material: Ceramic; Capacitance: 2.2uF; Package Quantity: 1; Weight: 7.1E-05oz; Length: 1.6mm; Thickness: 0.035inch; Tolerance: 10%
C13 = CMP-2006-02792-2: Chip Multilayer Ceramic Capacitors for General Purpose, 0603, 10uF, X5R, 15%, 20%, 6.3V / GRM188R60J106ME47D; Packaging: Tape and Reel; Voltage Rating (DC): 6.3V; Width: 0.031inch; Termination: SMD/SMT; Dielectric: X5R; Package Quantity: 4000; Voltage Rating: 6.3V; Capacitance: 10uF; Case/Package: 0603; Min Operating Temperature: -55°C; Voltage: 6.3V; Length: 1.6mm; Thickness: 0.035inch; Lead Free: Lead Free; Depth: 0.8mm; Case Code (Imperial): 0603; Max Operating Temperature: 85°C; Material: Ceramic; Height: 0.8mm; Tolerance: 20%; Mount: Surface Mount; REACH SVHC: No SVHC; Radiation Hardening: No; Case Code (Metric): 1608